# EAGLE design mini_bot2 (EAGLE 9.1.3)
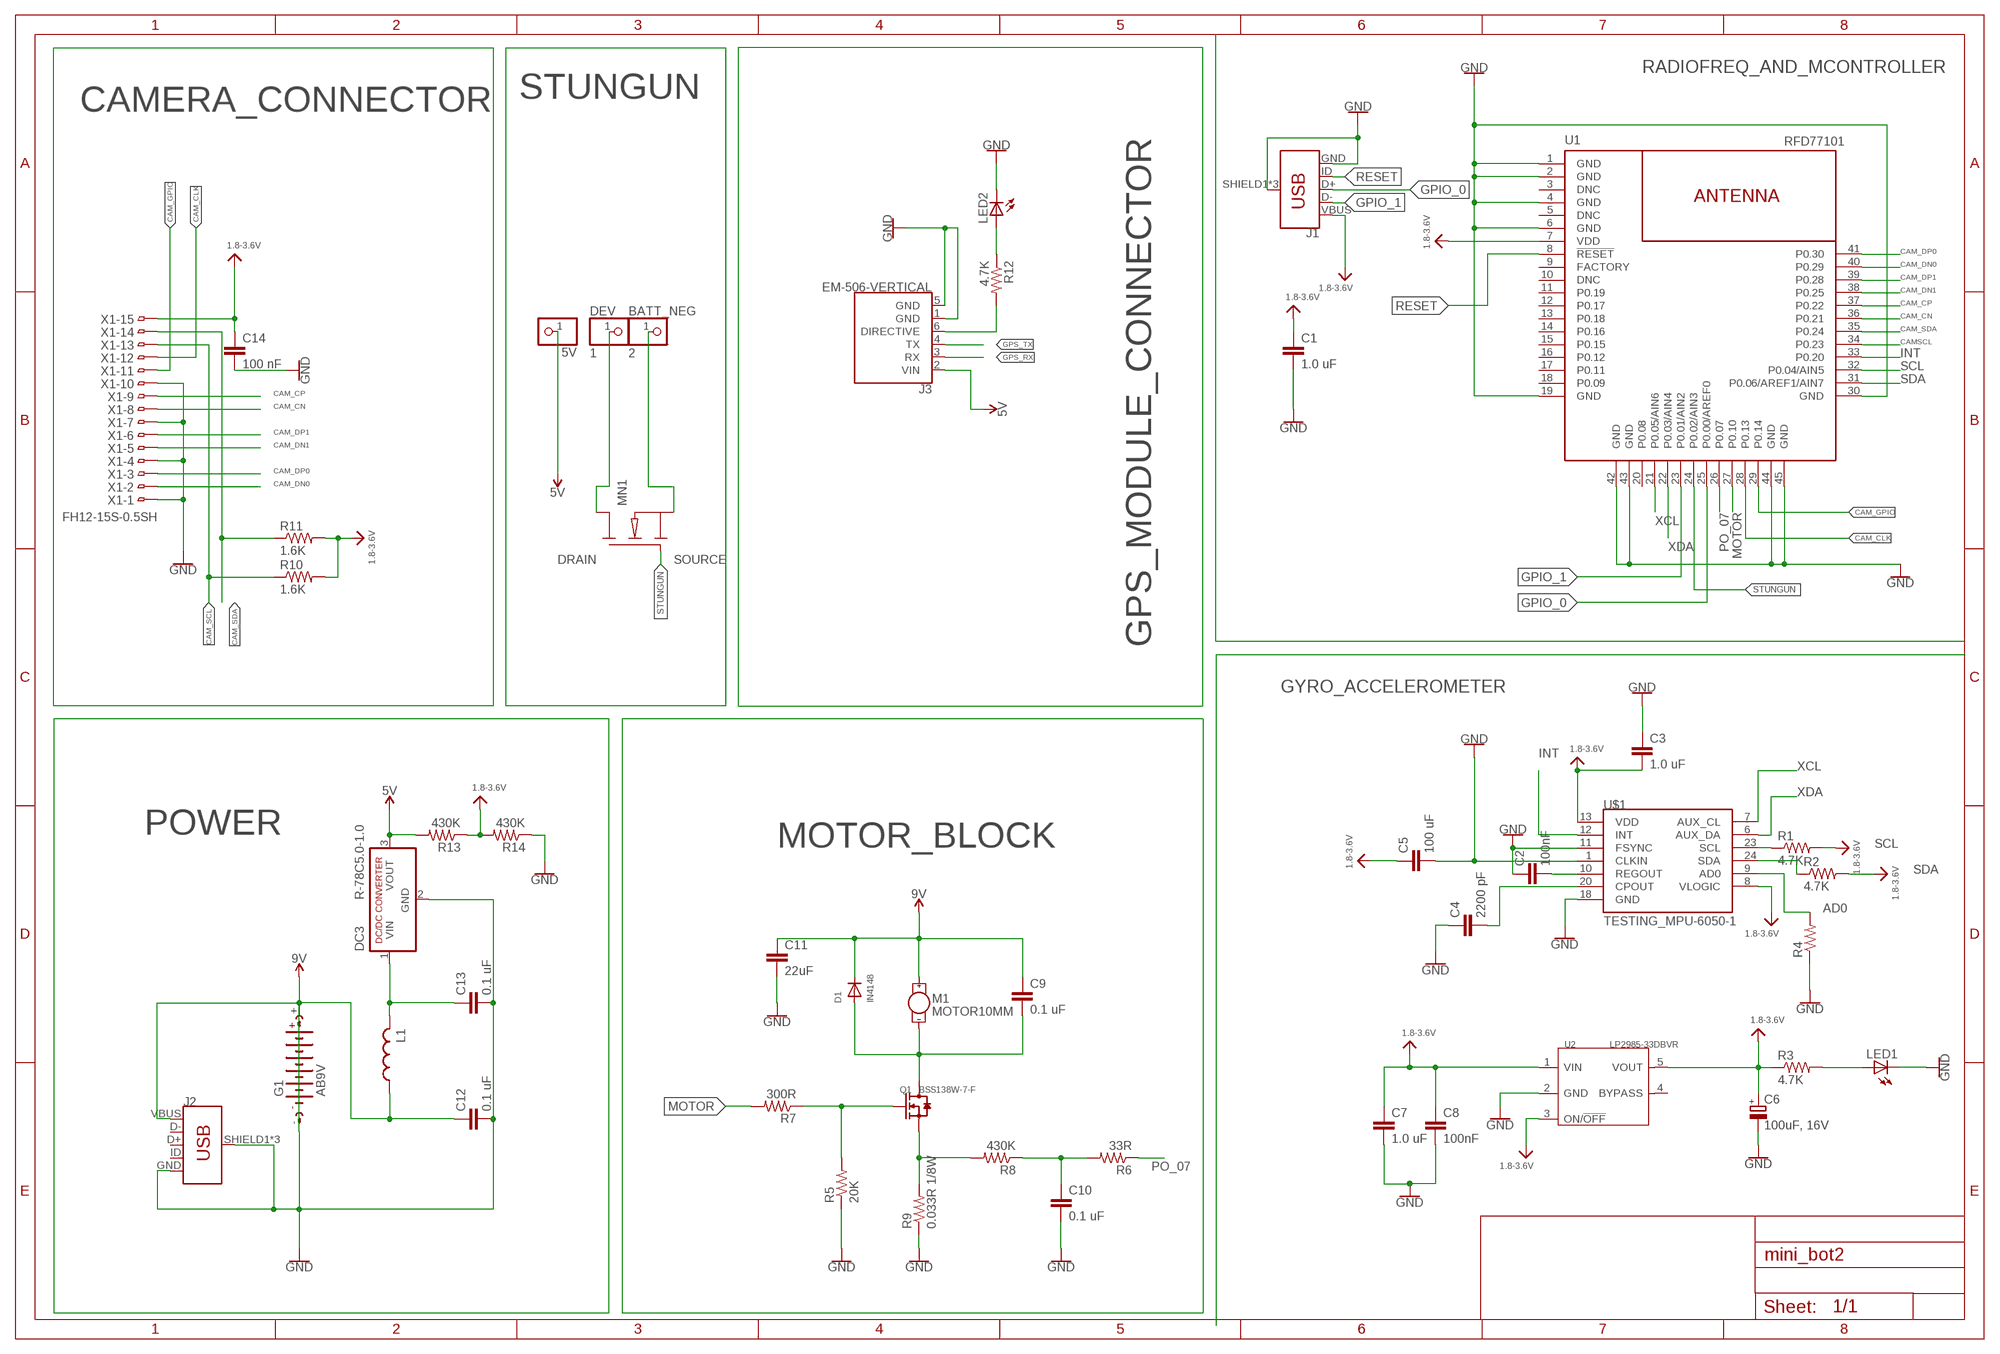
[diagram p0: schematic, sheet 1]

## Parts
5V  PINHD-1X1  [1X01]
BATT_NEG  2  PINHD-1X1  [1X01]
C1  1.0 uF  C2,5-3  [C2.5-3]
C2  100nF  C2,5-3  [C2.5-3]
C3  1.0 uF  C2,5-3  [C2.5-3]
C4  2200 pF  C2,5-3  [C2.5-3]
C5  100 uF  C2,5-3  [C2.5-3]
C6  100uF, 16V  CPOL-EUA/3216-18R  [A/3216-18R]
C7  1.0 uF  C2,5-3  [C2.5-3]
C8  100nF  C2,5-3  [C2.5-3]
C9  0.1 uF  C2,5-3  [C2.5-3]
C10  0.1 uF  C2,5-3  [C2.5-3]
C11  22uF  C2,5-3  [C2.5-3]
C12  0.1 uF  C2,5-3  [C2.5-3]
C13  0.1 uF  C2,5-3  [C2.5-3]
C14  100 nF  C2,5-3  [C2.5-3]
D1  IN4148  DIODEDO-1N4148  [DO-1N4148]
DC3  R-78C5.0-1.0  [SIP3]
DEV  1  PINHD-1X1  [1X01]
G1  AB9V  [AB9V]
J1  USB_MICRO-BREDUCED_PASTE  [USB-B-MICRO-SMD_RED_PASTE]
J2  USB_MICRO-BREDUCED_PASTE  [USB-B-MICRO-SMD_RED_PASTE]
J3  EM-506-VERTICAL  [JST-6PIN-1MM]
L1  L-USL1812  [L1812]
LED1  LEDCHIPLED_1206  [CHIPLED_1206]
LED2  LEDCHIPLED_1206  [CHIPLED_1206]
M1  MOTOR10MM  [VIBE-MOTOR-10MM]
MN1  NMOS  [SOT23]
Q1  BSS138W-7-F  SMD-MOSFET-N-CH-50V-200MA-BSS138W-7-F(SOT-23)  [SOT-23]
R1  4.7K  R-US_M0805  [M0805]
R2  4.7K  R-US_M0805  [M0805]
R3  4.7K  R-US_M0805  [M0805]
R4  R-US_M0805  [M0805]
R5  20K  R-US_M0805  [M0805]
R6  33R  R-US_M0805  [M0805]
R7  300R  R-US_M0805  [M0805]
R8  430K  R-US_M0805  [M0805]
R9  0.033R 1/8W  R-US_M0805  [M0805]
R10  1.6K  R-US_M0805  [M0805]
R11  1.6K  R-US_M0805  [M0805]
R12  4.7K  R-US_M0805  [M0805]
R13  430K  R-US_M0805  [M0805]
R14  430K  R-US_M0805  [M0805]
U1  RFD77101  [RFD77101]
U2  LP2985-33DBVR  PMIC-LP2985-33DBVR(SOT23-5)  [SOT-23-5]
U$1  TESTING_MPU-6050-1  [TESTING_QFN-24-4MM2]
X1  FH12-15S-0.5SH  [FH12-15S-0.5SH]

## Nets
5V: 5V.1 DC3.3(VOUT) J3.2(VIN) R13.2
12V: C9.1 C11.1 C12.1 D1.C G1.+ J2.VBUS L1.1 M1.+ ; supply symbol labelled 9V
AD0: R4.2 U$1.9(AD0)
CAM_CLK: U1.28(P0.13) X1.12
CAM_CN: U1.36(P0.21) X1.8
CAM_CP: U1.37(P0.22) X1.9
CAM_DN0: U1.40(P0.29) X1.2
CAM_DN1: U1.38(P0.25) X1.5
CAM_DP0: U1.41(P0.30) X1.3
CAM_DP1: U1.39(P0.28) X1.6
CAM_GPIO: U1.29(P0.14) X1.11
CAM_SCL: R10.1 X1.13
CAM_SDA: R11.1 U1.35(P0.24) X1.14
CAMSCL: U1.34(P0.23)
DRAIN: DEV.1 MN1.3(D)
GND: C1.2 C2.1 C3.1 C4.1 C5.2 C6.- C7.2 C8.2 C10.2 C11.2 C12.2 C13.2 C14.2 DC3.2(GND) G1.- J1.GND J1.SHIELD1(SHIELD) J1.SHIELD2(SHIELD) J1.SHIELD3(SHIELD) J2.GND J2.SHIELD1(SHIELD) J2.SHIELD2(SHIELD) J2.SHIELD3(SHIELD) J3.1(GND) J3.5(GND) LED1.C LED2.C R4.1 R5.1 R9.1 R14.1 U1.1(GND) U1.2(GND) U1.4(GND) U1.6(GND) U1.19(GND) U1.30(GND) U1.42(GND) U1.43(GND) U1.44(GND) U1.45(GND) U2.2(GND) U$1.1(CLKIN) U$1.11(FSYNC) U$1.18(GND) X1.1 X1.4 X1.7 X1.10
GPIO_0: J1.D+ U1.25(P0.00/AREF0)
GPIO_1: J1.D- U1.23(P0.01/AIN2)
GPS_RX: J3.3(RX)
GPS_TX: J3.4(TX)
INT: U1.33(P0.20) U$1.12(INT)
MOTOR: R7.2 U1.27(P0.10)
N$1: C9.2 D1.A M1.- Q1.3(D)
N$2: LED1.A R3.2
N$3: C4.2 U$1.20(CPOUT)
N$4: C2.2 U$1.10(REGOUT)
N$5: C13.1 DC3.1(VIN) L1.2
N$6: Q1.2(S) R8.2 R9.2
N$7: C10.1 R6.2 R8.1
N$8: Q1.1(G) R5.2 R7.1
N$9: J3.6(DIRECTIVE) R12.2
N$12: LED2.A R12.1
PO_07: R6.1 U1.26(P0.07)
RESET: J1.ID U1.8(!RESET!)
SCL: R1.1 U1.32(P0.04/AIN5) U$1.23(SCL)
SDA: R2.1 U1.31(P0.06/AREF1/AIN7) U$1.24(SDA)
SOURCE: BATT_NEG.1 MN1.2(S)
STUNGUN: MN1.1(G) U1.24(P0.02/AIN3)
VCC: C1.1 C3.2 C5.1 C6.+ C7.1 C8.1 C14.1 J1.VBUS R1.2 R2.2 R3.1 R10.2 R11.2 R13.1 R14.2 U1.7(VDD) U2.1(VIN) U2.3(ON/!OFF) U2.5(VOUT) U$1.8(VLOGIC) U$1.13(VDD) X1.15 ; supply symbol labelled 1.8-3.6V
XCL: U1.21(P0.05/AIN6) U$1.7(AUX_CL)
XDA: U1.22(P0.03/AIN4) U$1.6(AUX_DA)
Unconnected: J2.D+ J2.D- J2.ID U1.3(DNC) U1.5(DNC) U1.9(FACTORY) U1.10(DNC) U1.11(P0.19) U1.12(P0.17) U1.13(P0.18) U1.14(P0.16) U1.15(P0.15) U1.16(P0.12) U1.17(P0.11) U1.18(P0.09) U1.20(P0.08) U2.4(BYPASS)

## Library data of the parts
5V BATT_NEG DEV = adafruit:PINHD-1X1: Pin header 1x1 for 0.1" spacing With round pins
C1-C5 C7-C14 = capacitor-wima:C: CAPACITOR naming: grid - package width
C6 = rcl:CPOL-EU: POLARIZED CAPACITOR, European symbol; SPICEPREFIX: C
D1 = adafruit:DIODE: Diode SMADIODE - SMA Surface Mount Package 20V 1A Schottky Diode Digikey: 641-1014-6-ND DO-1N4148 - Through Hole Small Current Diode SOD-123 20V 1 A (.5mV Vf) Schottky Diode - Digikey: MBRX120TPMSCT-ND SOD-323 10V 570mA (.38mV Vf, 3ns) Schottky Diode - Digikey: ZLLS410CT-ND SOD-523 30V 30mA Schottky Diode (RB751S-40TE61) - Digikey: RB751S-40TE61CT-ND SOT23-R/W - SOT23 Package (R = Solder Paste/Reflow Ovens, W = Hand-Soldering) BAT54Film 40V 300mA - Digikey: 497-7162-1-ND
DC3 = dc-dc-converter:R-78C*-1.0: INNOLINE DC/DC-Converter 1.0 AMP SIP3 Single Output Source: Data sheet <http://www.mikrocontroller.net/attachment/150645/157764-da-01-en-DC_DC_WANDLER_R_78C5_0_1_0.pdf>
G1 = battery:AB9V: 9-V BATTERY CLIP
J1 J2 = SparkFun-Connectors:USB_MICRO-B: USB Type Micro-B Connector Male/female and PTH/SMT variants SparkFun Products: SparkFun microB USB Breakout <https://www.sparkfun.com/products/12035> SparkFun USB microB Plug Breakout <https://www.sparkfun.com/products/10031> SparkFun ESP8266 Thing <https://www.sparkfun.com/products/13231>; PROD_ID: CONN-11752
J3 = SparkFun-GPS:EM-506: USGlobalSat EM-506 High Performance GPS Module EM-506 GPS module features high sensitivity, low power and ultra small form factor. This GPS module is powered by SiRF Star IV, it can provide you with superior sensitivity and performance even in urban canyon and dense foliage environment. With SiRF CGEE (Client Generated Extended Ephemeris) technology, it predicts satellite positions for up to 3 days and delivers CGEE-start time of less than 15 seconds under most conditions, without any network assistance. Besides, MicroPower Mode allows GPS module to stay in a hot-start condition nearly continuously while consuming very little power. SparkFun Products GPS Receiver - EM-506 (48 Channel) <https://www.sparkfun.com/products/12751> (GPS-12751); PROD_ID: CONN-08249
L1 = rcl:L-US: INDUCTOR, American symbol; SPICEPREFIX: L
LED1 LED2 = led:LED: LED OSRAM: - CHIPLED LG R971, LG N971, LY N971, LG Q971, LY Q971, LO R971, LY R971 LH N974, LH R974 LS Q976, LO Q976, LY Q976 LO Q996 - Hyper CHIPLED LW Q18S LB Q993, LB Q99A, LB R99A - SideLED LS A670, LO A670, LY A670, LG A670, LP A670 LB A673, LV A673, LT A673, LW A673 LH A674 LY A675 LS A676, LA A676, LO A676, LY A676, LW A676 LS A679, LY A679, LG A679 - Hyper Micro SIDELED® LS Y876, LA Y876, LO Y876, LY Y876 LT Y87S - SmartLED LW L88C, LW L88S LB L89C, LB L89S, LG L890 LS L89K, LO L89K, LY L89K LS L896, LA L896, LO L896, LY L896 - TOPLED LS T670, LO T670, LY T670, LG T670, LP T670 LSG T670, LSP T670, LSY T670, LOP T670, LYG T670 LG T671, LOG T671, LSG T671 LB T673, LV T673, LT T673, LW T673 LH T674 LS T676, LA T676, LO T676, LY T676, LB T676, LH T676, LSB T676, LW T676 LB T67C, LV T67C, LT T67C, LS T67K, LO T67K, LY T67K, LW E67C LS E67B, LA E67B, LO E67B, LY E67B, LB E67C, LV E67C, LT E67C LW T67C LS T679, LY T679, LG T679 LS T770, LO T770, LY T770, LG T770, LP T770 LB T773, LV T773, LT T773, LW T773 LH T774 LS E675, LA E675, LY E675, LS T675 LS T776, LA T776, LO T776, LY T776, LB T776 LHGB T686 LT T68C, LB T68C - Hyper Mini TOPLED® LB M676 - Mini TOPLED Santana® LG M470 LS M47K, LO M47K, LY M47K Source: http://www.osram.convergy.de LUXEON: - LUMILED® LXK2-PW12-R00, LXK2-PW12-S00, LXK2-PW14-U00, LXK2-PW14-V00 LXK2-PM12-R00, LXK2-PM12-S00, LXK2-PM14-U00 LXK2-PE12-Q00, LXK2-PE12-R00, LXK2-PE12-S00, LXK2-PE14-T00, LXK2-PE14-U00 LXK2-PB12-K00, LXK2-PB12-L00, LXK2-PB12-M00, LXK2-PB14-N00, LXK2-PB14-P00, LXK2-PB14-Q00 LXK2-PR12-L00, LXK2-PR12-M00, LXK2-PR14-Q00, LXK2-PR14-R00 LXK2-PD12-Q00, LXK2-PD12-R00, LXK2-PD12-S00 LXK2-PH12-R00, LXK2-PH12-S00 LXK2-PL12-P00, LXK2-PL12-Q00, LXK2-PL12-R00 Source: www.luxeon.com KINGBRIGHT: KA-3528ASYC Source: www.kingbright.com
M1 = SparkFun-Electromechanical:MOTOR: Motor (Single-Phase) Two-terminal, single-phase motors. SparkFun Products Vibration Motor <https://www.sparkfun.com/products/8449> (ROB-08449) Physical dimension and wire connections for this powerful vibration motor. Motor has a self adhesive backing.; PROD_ID: COMP-08572; SF_SKU: ROB-08449
MN1 = sym:NMOS: N-Channel MOSFET transistor
Q1 = Seeed-Transistor:SMD-MOSFET-N-CH-50V-200MA-BSS138W-7-F(SOT-23): 305030000; MPN: BSS138W-7-F
R1-R14 = adafruit:R-US_: RESISTOR, American symbol
U1 = SparkFun-RF:RFD77101: Simblee  BLE Module RFD77101 © 2015 RF Digital Corporation Datasheet <https://cdn.sparkfun.com/datasheets/IoT/Simblee%20RFD77101%20Datasheet%20v1.0.pdf> PATENTS PENDING 04.01.2015 Bluetooth Smart radio transceiver, ARM Cortex M0 microcontroller. 128kB Flash, 24kB RAM, no EEPROM Arduino-compatible. SparkFun Products: Simblee BLE Module - RFD77101 <https://www.sparkfun.com/products/13808> SparkFun Simblee BLE Breakout - RFD77101 <https://www.sparkfun.com/products/13632>; PROD_ID: COMP-13237; SF_ID: WRL-13808
U2 = Seeed-IC:PMIC-LP2985-33DBVR(SOT23-5): 310030033; MPN: LP2985-33DBVR
U$1 = Triple_Axis_Accelerometer_MPU-6050:TESTING_MPU-6050
X1 = con-hirose:FH12-15S-0.5S: 0.5mm Pitch Connectors For FPC/FFC Source: Data sheet <http://www.hirose.co.jp/cataloge_hp/e58605370.pdf>; OC_FARNELL: 1324545; OC_NEWARK: unknown

## Board
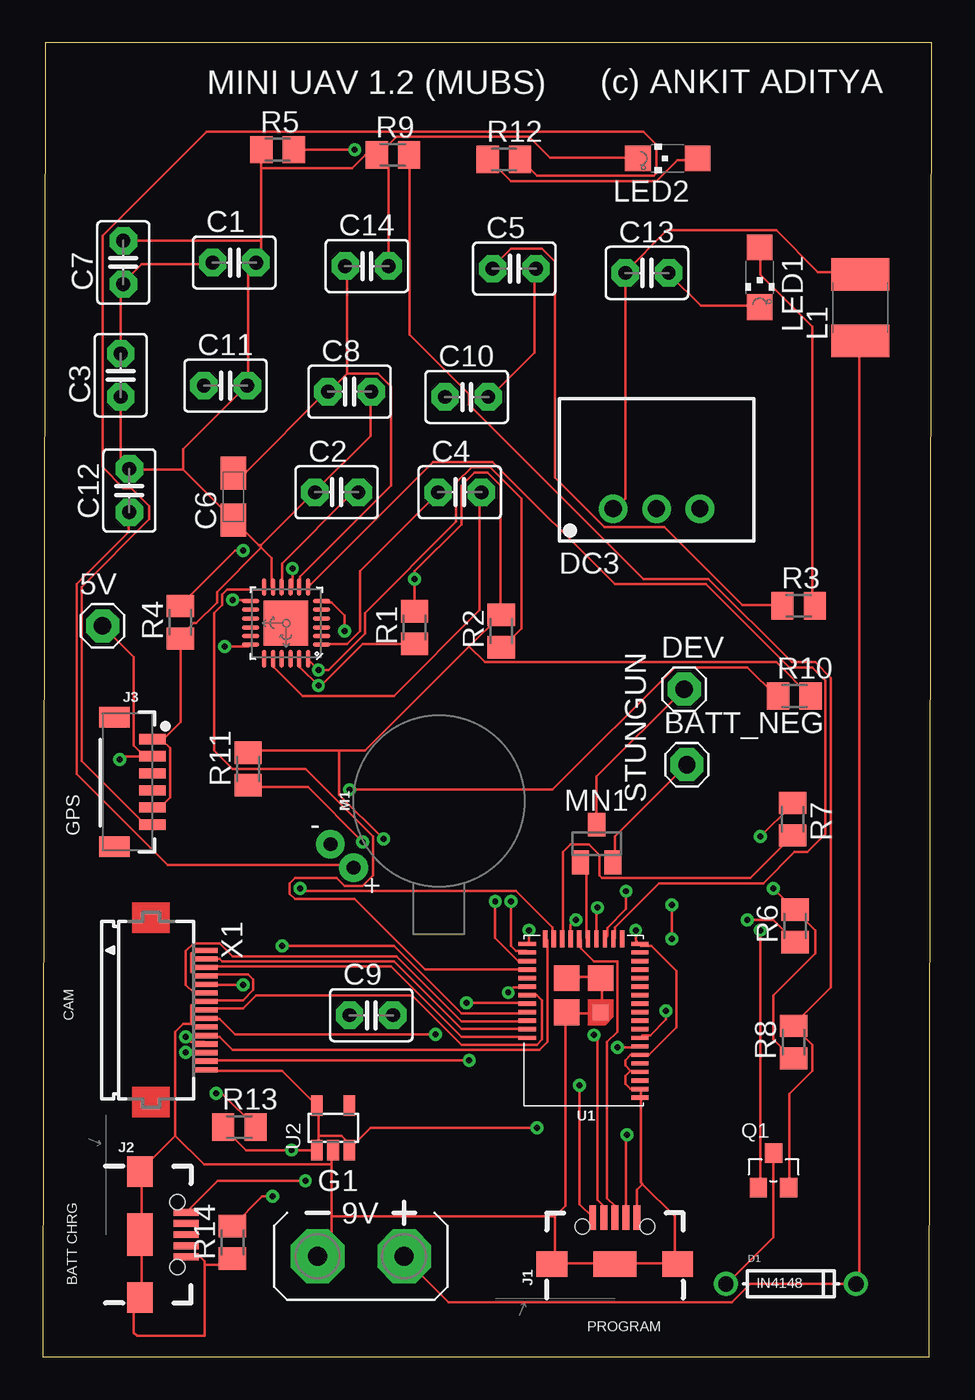
[diagram p1: board, top side]
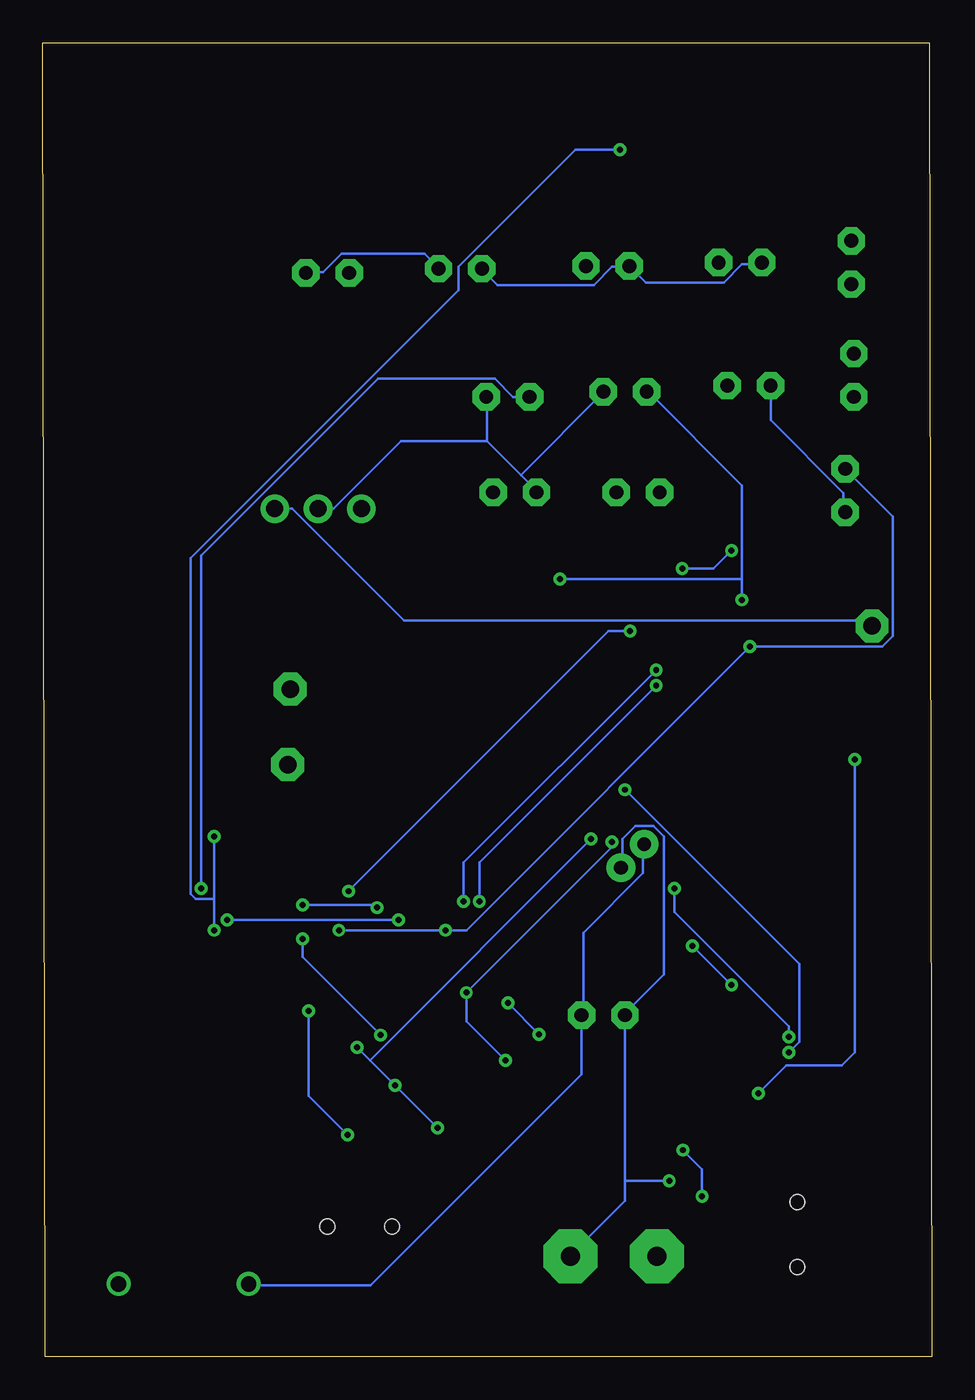
[diagram p2: board, bottom side, seen from below]

Size 52.1 x 76.99 mm. Coordinates in mm from the lower left corner, seen from the top.
Outline: 0,0 51.95,0 52.1,76.99 0.15,76.99 0,0
Copper layers (1*16): Top 0.035mm / dielectric 1.5mm / Bottom 0.035mm
Design rules "default": minimum track width 6mil, minimum drill 0.35mm, track to track 6mil, track to pad 6mil, pad to pad 6mil, via to via 6mil, smd to smd 6mil, copper to edge 40mil, drill to drill 6mil, minimum pad ring 10mil, minimum via ring 8mil, stop-mask expansion 4mil, vias tented up to drill 0mil, thermal gap 10mil

### Footprints (pad centres in the part's own frame; a part is rotated, then mirrored left to right if it is on the bottom)
1X01 = drill 1.016 pad 1.93 octagon: 1 0,0
C2.5-3 = drill 0.813 pad 1.6 octagon: 1 -1.27,0; 2 1.27,0
A/3216-18R = smd 1.95 x 1.5: + 1.375,0; - -1.375,0
DO-1N4148 = drill 0.9: A -3.81,0; C 3.81,0
SIP3 = drill 1 pad 1.676: 1 -2.54,0; 2 0,0; 3 2.54,0
AB9V = drill 1.118 pad 3.15 octagon: + 0,2.54; - 0,-2.54
USB-B-MICRO-SMD_RED_PASTE = smd 1.45 x 0.4: D+ 2.725,0; D- 2.725,0.65; GND 2.725,-1.3; ID 2.725,-0.65; VBUS 2.725,1.3 | smd 1.5 x 1.8: SHIELD1 0,3.685; SHIELD2 0,-3.685 | smd 1.5 x 2.5: SHIELD3 0,0 | hole 0.85: 2.2,1.9; 2.2,-1.9
JST-6PIN-1MM = smd 0.6 x 1.55: 1 -2.5,1.45; 2 -1.5,1.45; 3 -0.5,1.45; 4 0.5,1.45; 5 1.5,1.45; 6 2.5,1.45 | smd 1.2 x 1.8: P$1 -3.8,-0.775; P$2 3.8,-0.775
L1812 = smd 1.9 x 3.4: 1 -1.95,0; 2 1.95,0
CHIPLED_1206 = smd 1.5 x 1.5: A 0,-1.75; C 0,1.75
VIBE-MOTOR-10MM = drill 0.8 pad 1.676: + -5,-3.9; - -6.35,-2.54
SOT23 = smd 1 x 1.4: 1 -0.95,-1.1; 2 0.95,-1.1; 3 0,1.1
SOT-23 = smd 1.016 x 1.143: 1 -0.889,-1.016; 2 0.889,-1.016; 3 0,1.016
M0805 = smd 1.3 x 1.6: 1 -0.95,0; 2 0.95,0
RFD77101 = smd 1 x 0.254: 1 0,0; 2 0,-0.5; 3 0,-1; 4 0,-1.5; 5 0,-2; 6 0,-2.5; 7 0,-3; 8 0,-3.5; 9 0,-4; 10 0,-4.5; 11 0,-5; 12 0,-5.5; 13 0,-6; 14 0,-6.5; 15 0,-7; 16 0,-7.5; 17 0,-8; 18 0,-8.5; 19 0,-9; 30 6.61,-9; 31 6.61,-8.5; 32 6.61,-8; 33 6.61,-7.5; 34 6.61,-7; 35 6.61,-6.5; 36 6.61,-6; 37 6.61,-5.5; 38 6.61,-5; 39 6.61,-4.5; 40 6.61,-4; 41 6.61,-3.5 | smd 0.254 x 1: 20 1.055,-9.29; 21 1.555,-9.29; 22 2.055,-9.29; 23 2.555,-9.29; 24 3.055,-9.29; 25 3.555,-9.29; 26 4.055,-9.29; 27 4.555,-9.29; 28 5.055,-9.29; 29 5.555,-9.29 | smd 0.9 x 0.9: 42 2.3,-4.99 | smd 1.5 x 1.5: 43 2.3,-6.99; 44 4.3,-6.99; 45 4.3,-4.99
SOT-23-5 = smd 0.69 x 1.2: 1 -0.95,-1.3; 2 0,-1.3; 3 0.95,-1.3; 4 0.95,1.3; 5 -0.95,1.3
TESTING_QFN-24-4MM2 = smd 1.016 x 0.254: 1 -2.066,1.257; 2 -2.066,0.75; 3 -2.066,0.247; 4 -2.066,-0.287; 5 -2.066,-0.792; 6 -2.066,-1.297; 13 2.086,-1.297; 14 2.086,-0.792; 15 2.086,-0.287; 16 2.086,0.247; 17 2.086,0.75; 18 2.086,1.257 | smd 0.254 x 1.016: 7 -1.267,-2.122; 8 -0.762,-2.122; 9 -0.258,-2.122; 10 0.278,-2.122; 11 0.78,-2.122; 12 1.287,-2.122; 19 1.287,2.082; 20 0.78,2.082; 21 0.278,2.082; 22 -0.258,2.082; 23 -0.762,2.082; 24 -1.267,2.082 | smd 2.616 x 2.616: P$1 0.02,-0.01
FH12-15S-0.5SH = smd 0.3 x 1.3: 1 -3.5,3.25; 2 -3,3.25; 3 -2.5,3.25; 4 -2,3.25; 5 -1.5,3.25; 6 -1,3.25; 7 -0.5,3.25; 8 0,3.25; 9 0.5,3.25; 10 1,3.25; 11 1.5,3.25; 12 2,3.25; 13 2.5,3.25; 14 3,3.25; 15 3.5,3.25

### Placement (x,y rotation side)
5V  3.51,42.82 0 top
BATT_NEG  37.74,34.7 0 top
C1  11.23,64.11 0 top
C2  17.22,50.65 0 top
C3  4.57,57.51 90 top
C4  24.43,50.65 0 top
C5  27.64,63.75 0 top
C6  11.18,50.39 90 top
C7  4.72,64.11 90 top
C8  17.98,56.54 0 top
C9  19.25,20.02 0 top
C10  24.84,56.24 0 top
C11  10.72,56.9 0 top
C12  5.08,50.75 90 top
C13  35.41,63.5 0 top
C14  19,63.91 0 top
D1  43.84,4.27 0 top
DC3  35.97,49.68 0 top
DEV  37.59,39.12 0 top
G1  18.64,5.89 270 top
J1  33.53,5.44 90 top
J2  5.69,7.16 0 top
J3  4.98,33.68 270 top
L1  47.9,61.47 90 top
LED1  42.01,63.25 180 top
LED2  36.63,70.21 90 top
M1  23.22,32.56 0 top
MN1  32.46,30.07 0 top
Q1  42.82,10.92 0 top
R1  21.79,42.72 90 top
R2  26.87,42.52 90 top
R3  44.3,43.99 0 top
R4  8.08,43.03 90 top
R5  13.77,70.71 0 top
R6  44.09,25.25 90 top
R7  43.94,31.5 270 top
R8  43.99,18.44 90 top
R9  20.52,70.41 0 top
R10  44.04,38.71 0 top
R11  12.04,34.44 90 top
R12  27.03,70.15 0 top
R13  11.53,13.46 0 top
R14  11.13,6.71 90 top
U1  35,15.19 180 top
U2  17.02,13.41 0 top
U$1  14.27,42.98 180 top
X1  6.35,20.32 270 top

### Tracks (layer width: path | path; a pad name or v marks a point on that pad's centre or on a via)
5V  (via drill 0.35)
  Top 0.152: 5V.1 5.33,41 5.33,35.81 5.94,35.2 6.4,35.2 J3.2 4.7,35.18 v4.52,35 | R13.2 10.5,15.44 v10.16,15.44
  Bottom 0.152: DC3.3 37.49,49.68 30.94,43.13 3.81,43.13 5V.1 | v10.16,15.44 8.53,17.07 5.28,17.07 4.52,17.83 v4.52,35
12V  (via drill 0.35)
  Top 0.152: G1.+ 21.18,5.79 23.77,3.2 40.39,3.2 41.45,4.27 D1.C 47.7,4.27 47.85,4.42 47.85,59.44 L1.1 | C12.1 5.03,49.38 5.03,48.31 1.98,45.26 1.98,34.14 7.32,28.8 18.14,28.8 M1.+ | J2.VBUS 10.26,10.31 v15.39,10.31
  Bottom 0.152: C11.1 9.45,54.86 5.18,50.6 5.18,49.53 C12.1 | 17.98,10.31 17.98,10.36 C9.1 17.98,20.12 15.7,22.4 15.7,30.48 16.31,31.09 17.37,31.09 18.14,30.33 18.14,28.8 M1.+ | G1.+ 21.18,5.94 17.98,9.14 17.98,10.31 | v15.39,10.31 17.98,10.31
AD0  (via drill 0.35)
  Top 0.152: v14.63,46.18 14.63,45.11 U$1.9 | v11.73,47.24 11.28,47.24 8.08,44.04 R4.2
  Bottom 0.152: v14.63,46.18 12.8,46.18 v11.73,47.24
CAM_CLK  (via drill 0.35)
  Top 0.152: v15.09,27.43 15.24,27.28 27.74,27.28 29.87,25.15 29.87,24.54 U1.28 | v8.38,18.75 8.69,18.44 9.45,18.44 X1.12
  Bottom 0.152: v15.09,27.43 15.09,26.06 8.38,19.36 v8.38,18.75
CAM_CN
  Top 0.152: U1.36 28.5,21.18 28.96,21.18 29.26,20.88 29.26,18.59 28.96,18.29 24.54,18.29 21.64,21.18 12.5,21.18 11.73,20.42 9.6,20.42 X1.8
CAM_CP  (via drill 0.35)
  Top 0.152: v24.84,20.73 28.35,20.73 U1.37 | v23.01,18.9 11.28,18.9 10.36,19.81 X1.9
  Bottom 0.152: v23.01,18.9 v24.84,20.73
CAM_DN0
  Top 0.152: U1.40 28.35,19.2 24.54,19.2 20.57,23.16 10.52,23.16 10.36,23.32 X1.2
CAM_DN1  (via drill 0.35)
  Top 0.152: v14.02,24.08 20.57,24.08 24.54,20.12 28.35,20.12 U1.38 | v11.73,21.79 9.6,21.79 X1.5
  Bottom 0.152: v11.73,21.79 v14.02,24.08
CAM_DP0
  Top 0.152: U1.41 28.35,18.75 24.54,18.75 20.42,22.86 9.6,22.86 X1.3
CAM_DP1
  Top 0.152: U1.39 28.35,19.66 24.54,19.66 20.73,23.47 11.12,23.47 10.36,24.23 8.84,24.23 8.38,23.77 8.38,21.79 8.84,21.34 9.45,21.34 X1.6
CAM_GPIO
  Top 0.152: U1.29 29.57,24.38 29.57,18.44 29.11,17.98 11.12,17.98 10.36,18.75 9.6,18.75 X1.11
CAM_SCL  (via drill 0.35)
  Top 0.152: v8.38,17.83 9.45,17.83 X1.13 | v17.98,33.22 29.87,33.22 37.03,40.39 41.3,40.39 42.98,38.71 R10.1
  Bottom 0.152: v8.38,17.83 7.77,18.44 7.77,23.01 v17.98,33.22
CAM_SDA  (via drill 0.35)
  Top 0.152: v27.28,21.34 27.58,21.64 28.35,21.64 U1.35 | v24.99,17.37 9.6,17.37 X1.14 | v18.75,30.18 15.54,33.38 12.04,33.38 R11.1
  Bottom 0.152: v24.99,17.37 27.28,19.66 v27.28,21.34 18.75,29.87 v18.75,30.18
DRAIN
  Top 0.152: MN1.3 32.46,33.98 DEV.1
GND  (via drill 0.35)
  Top 0.152: 34.44,16.76 34.9,16.76 U1.4 | 34.44,16.76 34.14,17.07 34.14,17.37 34.44,17.68 34.9,17.68 U1.6 35.05,17.68 35.51,17.68 37.13,19.3 37.13,22.61 35.66,24.08 35.05,24.08 U1.19 34.9,24.23 34.75,24.38 v34.75,24.99 | 34.44,16.76 34.14,16.46 34.14,16 34.44,15.7 34.9,15.7 U1.2 35.05,15.7 35.05,15.24 U1.1 35.05,15.09 35.05,10.21 35.15,10.11 | v28.5,24.99 28.5,24.23 U1.30 | U1.44 30.79,22.25 32.61,22.25 U1.43 32.77,22.1 32.77,20.27 U1.42 32.61,20.12 30.79,20.12 U1.45 30.63,20.12 30.63,8.84 30.02,8.23 | 33.53,5.49 30.02,5.49 | 30.02,5.49 29.87,5.49 J1.SHIELD1 30.02,5.49 | 33.53,5.49 37.03,5.49 | 37.03,5.49 37.19,5.49 J1.SHIELD2 37.03,5.49 | 33.53,5.49 J1.SHIELD3 | 30.02,5.49 30.02,8.23 | 35.15,10.11 37.03,8.23 37.03,5.49 | 16.92,8.23 16.92,6.71 G1.- | 16.92,8.23 16.92,11.28 | 16.92,11.28 16.92,12.04 U2.2 | 8.69,19.51 8.84,19.36 9.45,19.36 X1.10 | 8.69,19.51 8.69,20.57 8.84,20.73 9.45,20.73 X1.7 9.6,20.88 11.73,20.88 12.34,21.49 12.34,22.1 12.04,22.4 9.6,22.4 X1.4 9.45,22.4 8.84,22.4 8.69,22.55 8.69,23.62 8.84,23.77 9.45,23.77 X1.1 | 5.79,7.16 5.79,3.5 J2.SHIELD2 5.69,3.3 5.33,2.95 5.33,1.42 5.54,1.22 9.5,1.22 9.5,5.38 | 5.79,7.16 5.79,10.82 J2.SHIELD1 5.79,10.97 7.77,12.95 | 5.79,7.16 J2.SHIELD3 | 8.69,19.51 8.23,19.51 7.77,19.05 7.77,12.95 | 16.92,11.28 9.45,11.28 7.77,12.95 | 16.92,8.23 30.02,8.23 | LED1.C 41.91,61.57 38.56,61.57 36.73,63.4 C13.2 | U$1.1 16.46,41.76 17.83,41.76 18.59,42.52 18.59,46.02 23.16,50.6 C4.1 | C5.2 28.8,63.7 28.8,58.83 26.21,56.24 C10.2 | v10.67,41.6 12.04,41.6 U$1.18 | C3.1 4.57,52.58 5.03,52.12 C12.2 5.18,51.97 8.23,51.97 | 7.01,36.12 7.47,35.66 7.47,32.77 7.01,32.31 6.55,32.31 J3.5
  Top 0.152: 7.01,36.12 6.55,36.12 J3.1 7.01,36.12 | 7.01,36.12 8.08,37.19 R4.1 8.08,42.22 8.84,42.98 8.99,42.98 10.21,44.2 10.21,44.81 12.8,47.4 | 12.65,47.55 11.28,48.92 C6.- 11.12,49.07 8.23,51.97 | 12.65,47.55 12.8,47.4 | 12.8,47.4 13.41,46.79 13.41,45.11 U$1.11 | 12.65,47.55 12.8,47.55 15.85,50.6 C2.1 16,50.75 19.2,53.95 19.2,56.54 C8.2 | 19.66,70.41 20.73,71.48 28.5,71.48 29.72,70.26 34.75,70.26 LED2.C | C14.2 20.27,69.8 19.66,70.41 | 19.66,70.41 R9.1 18.9,70.41 18.14,69.65 12.8,69.65 | 12.8,65.38 12.8,64.47 12.5,64.16 C1.2 12.5,64.01 12.04,63.55 12.04,57 C11.2 11.89,56.84 8.23,53.19 8.23,51.97 | 12.8,65.38 12.8,69.65 | 12.8,69.65 12.8,70.71 R5.1 | 12.8,65.38 C7.2 | 9.5,5.38 9.5,5.59 9.23,5.86 J2.GND | J1.GND 34.83,9.78 35.15,10.11 | R14.1 10.75,5.38 9.5,5.38
  Bottom 0.152: v34.75,24.99 v28.5,24.99 27.28,24.99 v10.67,41.6 2.9,41.6 2.29,42.22 2.29,49.23 C12.2 | 26.06,53.65 26.06,56.24 C10.2 | 24.08,51.66 23.16,50.75 C4.1 | 24.08,51.66 26.06,53.65 | DC3.2 35.05,49.68 31.09,53.65 26.06,53.65 | C13.2 36.58,63.55 35.66,63.55 34.59,64.62 29.72,64.62 28.96,63.86 C5.2 | 24.08,51.66 19.2,56.54 C8.2
GPIO_0
  Top 0.152: J1.D+ 33.53,8.84 33.07,9.3 33.07,18.44 33.68,19.05 33.68,23.16 32.31,23.16 31.55,23.93 31.55,24.38 U1.25
GPIO_1  (via drill 0.35)
  Top 0.152: J1.D- 32.88,8.83 32.51,9.2 32.51,18.64 v32.31,18.85 | v36.88,24.49 v36.88,26.47 | v32.51,26.31 32.45,26.25 U1.23
  Bottom 0.152: v32.31,18.85 36.88,23.42 v36.88,24.49 | v36.88,26.47 32.66,26.47 v32.51,26.31
INT
  Top 0.152: U1.33 28.35,22.71 22.4,22.71 18.29,26.82 14.78,26.82 14.48,27.13 14.48,27.74 14.78,28.04 17.22,28.04 17.68,27.58 18.75,27.58 19.36,28.19 19.36,30.48 15.39,34.44 11.12,34.44 10.06,35.51 10.06,43.59 10.52,44.04 10.52,44.65 10.82,44.96 12.95,44.96 U$1.12
MOTOR
  Top 0.152: U1.27 30.48,24.54 30.48,29.57 30.94,30.02 32,30.02 32.61,29.41 32.61,28.19 32.77,28.04 41.45,28.04 43.89,30.48 R7.2
N$1
  Top 0.152: Q1.3 42.82,7.01 40.08,4.27 D1.A
  Bottom 0.152: M1.- 16.92,30.02 16.92,28.35 20.42,24.84 20.42,20.12 C9.2 20.52,16.56 32.89,4.2 36.34,4.2 36.42,4.2 39.96,4.2 D1.A
N$2
  Top 0.152: LED1.A 42.06,64.92 42.06,63.4 45.11,60.35 45.11,44.04 R3.2
N$3
  Top 0.152: U$1.20 13.56,40.84 13.56,40.39 15.24,38.71 20.57,38.71 25.6,43.74 25.6,50.6 C4.2
N$4
  Top 0.152: U$1.10 14.02,45.11 14.02,46.48 18.14,50.6 18.44,50.6 C2.2
N$5
  Top 0.152: DC3.1 33.53,49.68 34.14,50.29 C13.1 34.14,63.55 36.58,65.99 42.98,65.99 45.41,63.55 47.85,63.55 L1.2
N$6
  Top 0.152: Q1.2 43.74,9.91 43.74,15.39 45.11,16.76 45.11,18.29 44.04,19.36 R8.2 44.04,19.51 46.18,21.64 46.18,39.78 45.26,40.69 43.89,40.69 39.01,45.57 35.2,45.57 24.99,55.78 24.99,56.39 21.49,59.89 21.49,70.41 R9.2
N$7  (via drill 0.35)
  Top 0.152: R8.1 43.89,17.53 42.82,18.59 42.82,21.18 45.26,23.62 45.26,24.99 44.2,26.06 R6.2 44.04,26.21 v42.82,27.43
  Bottom 0.152: C10.1 24.54,56.24 25.6,57.3 32.46,57.3 42.82,46.94 v42.82,27.43
N$8  (via drill 0.35)
  Top 0.152: v42.06,24.99 42.06,9.91 Q1.1 | v42.06,30.48 43.89,32.31 R7.1 | v18.29,70.71 R5.2
  Bottom 0.152: v42.06,30.48 42.06,26.82 | 42.06,26.82 v42.06,24.99 | v18.29,70.71 20.88,70.71 27.74,63.86 27.74,62.48 43.43,46.79 43.43,27.13 43.13,26.82 42.06,26.82
N$9
  Top 0.152: J3.6 6.4,31.24 5.94,31.24 2.29,34.9 2.29,45.11 6.25,49.07 6.25,49.84 5.18,50.9 4.72,50.9 3.5,52.12 3.5,65.68 9.6,71.78 35.2,71.78 35.97,71.02 35.97,69.34 35.81,69.19 28.96,69.19 28.04,70.1 R12.2
N$12
  Top 0.152: LED2.A 38.25,70.1 37.19,70.1 35.97,68.89 27.43,68.89 26.21,70.1 R12.1
PO_07  (via drill 0.35)
  Top 0.152: v31.24,25.6 30.94,25.3 30.94,24.54 U1.26 | v41.3,25.6 42.82,25.6 44.04,24.38 R6.1
  Bottom 0.152: v41.3,25.6 v31.24,25.6
RESET  (via drill 0.35)
  Top 0.152: J1.ID 34.18,12.94 v34.24,13.01 | U1.8 35.15,18.83 35.6,18.83 36.53,19.77 v36.53,20.27
  Bottom 0.152: v34.24,13.01 36.53,15.29 v36.53,20.27
SCL  (via drill 0.35)
  Top 0.152: v26.52,26.67 26.52,24.54 27.89,23.16 28.35,23.16 U1.32 | U$1.23 15.09,40.84 15.09,40.39 v16.15,39.32 16.31,39.32 18.75,41.76 21.79,41.76 R1.1
  Bottom 0.152: v26.52,26.67 26.52,28.96 v16.15,39.32
SDA  (via drill 0.35)
  Top 0.152: v27.43,26.67 27.43,24.08 27.74,23.77 28.35,23.77 U1.31 | U$1.24 15.54,40.84 v16.15,40.23 16.76,40.23 18.9,42.37 18.9,43.59 24.23,48.92 24.23,51.21 25.15,52.12 26.21,52.12 28.04,50.29 28.04,42.67 26.98,41.6 R2.1
  Bottom 0.152: v27.43,26.67 27.43,28.96 v16.15,40.23
SOURCE
  Top 0.152: BATT_NEG.1 33.53,30.48 33.53,29.11 MN1.2
STUNGUN
  Top 0.152: U1.24 31.85,24.54 31.85,28.65 31.55,28.96 MN1.1
VCC  (via drill 0.35)
  Top 0.152: C3.2 4.57,62.64 4.72,62.79 C7.1 4.72,62.94 5.79,64.01 9.91,64.01 C1.1 | v11.12,44.35 12.04,44.35 U$1.13 | 17.83,57.61 19.66,57.61 20.42,56.84 20.42,51.05 15.09,45.72 15.09,45.11 U$1.8 | 17.83,57.61 16.76,56.54 C8.1 16.61,56.54 11.89,51.82 11.28,51.82 C6.+ | 17.83,57.61 17.83,63.86 C14.1 | R3.1 43.28,44.04 41,44.04 36.42,48.62 32.92,48.62 30.02,51.51 30.02,64.16 29.26,64.92 27.43,64.92 26.36,63.86 C5.1 | 16.15,12.95 16.15,14.63 U2.5 16,14.78 14.02,16.76 9.6,16.76 X1.15 | 16.15,12.95 16.15,12.19 U2.1 v14.58,12.11 11.93,12.11 R13.1 | v33.68,18.14 34.9,18.14 U1.7 | v28.96,13.41 19.2,13.41 18.14,12.34 | 18.14,12.34 17.98,12.19 U2.3 18.14,12.34 | 16.15,12.95 17.53,12.95 18.14,12.34 | 17.37,35.51 18.9,35.51 24.99,41.6 | 17.37,35.51 12.04,35.51 R11.2 | 24.99,41.6 26.82,43.43 R2.2 26.82,43.59 26.82,51.05 26.06,51.82 25.3,51.82 24.54,51.05 24.54,48.77 21.79,46.02 v21.79,45.57 R1.2 | 24.99,41.6 25.91,40.69 42.98,40.69 44.96,38.71 R10.2 | v19.96,30.33 17.37,32.92 17.37,35.51 | J1.VBUS 31.45,8.94 v31.45,15.9 | R14.2 12.87,9.4 v13.46,9.4
  Bottom 0.152: 11.12,45.57 11.12,51.05 16.61,56.54 C8.1 | 11.12,45.57 v11.12,44.35 | C1.1 10.06,64.01 11.12,64.01 12.19,62.94 16.76,62.94 C14.1 17.83,63.86 18.75,63.86 19.81,62.79 25.45,62.79 26.36,63.7 C5.1 | v28.96,13.41 v31.45,15.9 32.92,17.37 | 32.92,17.37 v33.68,18.14 | v19.96,30.33 32.92,17.37 | v21.79,45.57 11.12,45.57 | v13.46,9.4 13.46,10.99 v14.58,12.11
XCL
  Top 0.152: U1.21 33.53,24.54 33.53,25.15 36.12,27.74 42.22,27.74 44.04,29.57 44.81,29.57 45.87,30.63 45.87,39.62 45.11,40.39 43.74,40.39 38.86,45.26 33.53,45.26 26.36,52.43 22.86,52.43 U$1.7
XDA  (via drill 0.35)
  Top 0.152: v17.68,42.52 17.68,43.43 16.92,44.2 16.46,44.2 U$1.6 | 32.93,24.49 32.92,24.49 | 32.93,24.49 U1.22 | 32.93,24.49 33.09,24.65 33.09,25.14 34.19,26.24 v34.19,27.28
  Bottom 0.152: v34.19,27.28 18.95,42.52 v17.68,42.52

### Text on the board
tNames: MINI UAV 1.2 (MUBS) | (c) ANKIT ADITYA | STUNGUN | GPS | CAM | BATT CHRG | PROGRAM